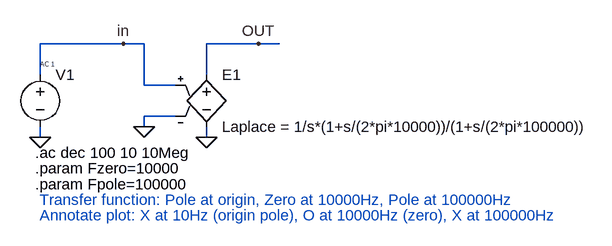
[diagram p0: schematic PoleZeroPair_Laplace.asc]
PoleZeroPair_Laplace.asc, the LTspice schematic file:
Version 4.1
SHEET 1 880 680
WIRE 80 96 -48 96
WIRE 112 96 80 96
WIRE 288 96 208 96
WIRE 320 96 288 96
WIRE -48 144 -48 96
WIRE 208 144 208 96
WIRE 112 160 112 96
WIRE 160 160 112 160
WIRE 160 208 112 208
WIRE 112 224 112 208
WIRE -48 240 -48 224
WIRE 208 240 208 224
FLAG -48 240 0
FLAG 208 240 0
FLAG 80 96 in
FLAG 112 224 0
FLAG 288 96 OUT
SYMBOL voltage -48 128 R0
WINDOW 123 0 0 Left 0
WINDOW 39 0 0 Left 0
SYMATTR SpiceLine AC 1
SYMATTR InstName V1
SYMATTR Value ""
SYMBOL e 208 128 R0
SYMATTR InstName E1
SYMATTR Value Laplace = 1/s*(1+s/(2*pi*10000))/(1+s/(2*pi*100000))
TEXT -56 264 Left 2 !.ac dec 100 10 10Meg
TEXT -56 288 Left 2 !.param Fzero=10000
TEXT -56 312 Left 2 !.param Fpole=100000
TEXT -56 336 Left 2 ; Transfer function: Pole at origin, Zero at 10000Hz, Pole at 100000Hz
TEXT -56 360 Left 2 ; Annotate plot: X at 10Hz (origin pole), O at 10000Hz (zero), X at 100000Hz

The netlist it stands for:
* PoleZeroPair_Laplace.asc
V1 in 0 AC 1
E1 OUT 0 in 0 Laplace = 1/s*(1+s/(2*pi*10000))/(1+s/(2*pi*100000))
.ac dec 100 10 10Meg
.param Fzero=10000
.param Fpole=100000
*  Transfer function: Pole at origin, Zero at 10000Hz, Pole at 100000Hz
*  Annotate plot: X at 10Hz (origin pole), O at 10000Hz (zero), X at 100000Hz
.backanno
.end